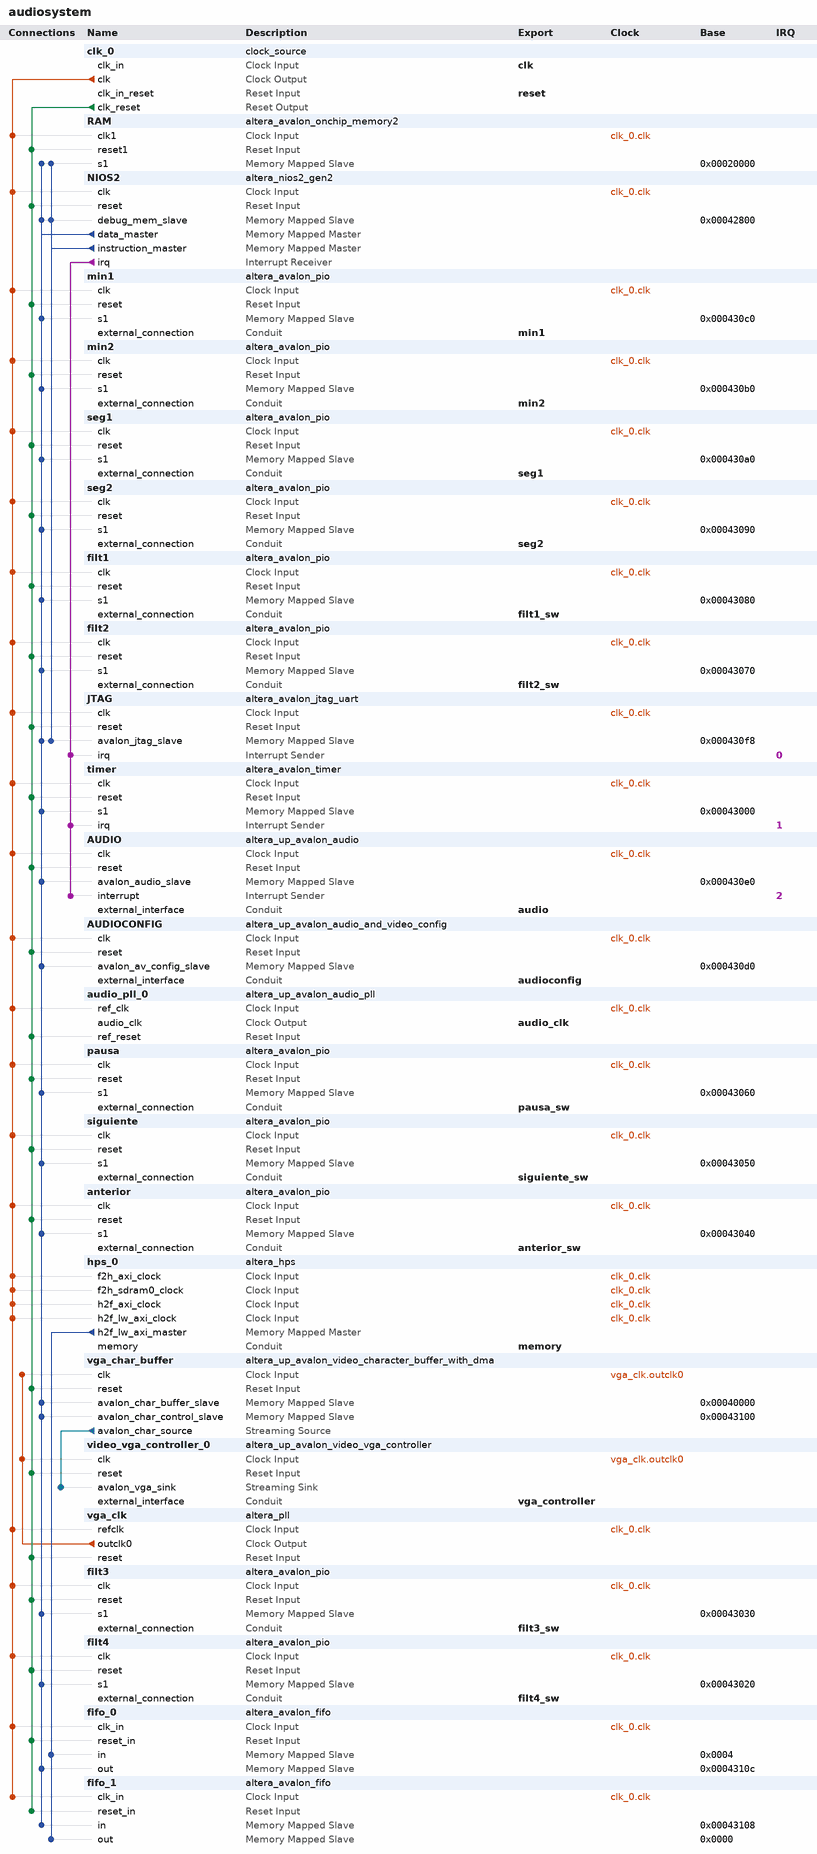
[diagram p0: system contents]
# Platform Designer (Qsys) system audiosystem, Cyclone V 5CSEMA5F31C6
# Parameters at their usual value, and those the tool derives, are not listed.
package require -exact qsys 18.1
create_system audiosystem
set_project_property DEVICE_FAMILY {Cyclone V}
set_project_property DEVICE 5CSEMA5F31C6

add_instance clk_0 clock_source 18.1
set_instance_parameter_value clk_0 clockFrequency 50000000

add_instance RAM altera_avalon_onchip_memory2 18.1
set_instance_parameter_value RAM dataWidth 32
set_instance_parameter_value RAM dualPort false
set_instance_parameter_value RAM initMemContent true
set_instance_parameter_value RAM initializationFileName onchip_mem.hex
set_instance_parameter_value RAM memorySize 131072

add_instance NIOS2 altera_nios2_gen2 18.1
set_instance_parameter_value NIOS2 dcache_size 2048
set_instance_parameter_value NIOS2 exceptionSlave RAM.s1
set_instance_parameter_value NIOS2 icache_size 4096
set_instance_parameter_value NIOS2 impl Tiny
set_instance_parameter_value NIOS2 resetSlave RAM.s1

add_instance min1 altera_avalon_pio 18.1
set_instance_parameter_value min1 direction Output
set_instance_parameter_value min1 width 7

add_instance min2 altera_avalon_pio 18.1
set_instance_parameter_value min2 direction Output
set_instance_parameter_value min2 width 7

add_instance seg1 altera_avalon_pio 18.1
set_instance_parameter_value seg1 direction Output
set_instance_parameter_value seg1 width 7

add_instance seg2 altera_avalon_pio 18.1
set_instance_parameter_value seg2 direction Output
set_instance_parameter_value seg2 width 7

add_instance filt1 altera_avalon_pio 18.1
set_instance_parameter_value filt1 direction Input
set_instance_parameter_value filt1 width 1

add_instance filt2 altera_avalon_pio 18.1
set_instance_parameter_value filt2 direction Input
set_instance_parameter_value filt2 width 1

add_instance JTAG altera_avalon_jtag_uart 18.1
set_instance_parameter_value JTAG simInteractiveOptions NO_INTERACTIVE_WINDOWS

add_instance timer altera_avalon_timer 18.1
set_instance_parameter_value timer period 1
set_instance_parameter_value timer periodUnits SEC

add_instance AUDIO altera_up_avalon_audio 18.0
set_instance_parameter_value AUDIO audio_in true
set_instance_parameter_value AUDIO avalon_bus_type {Memory Mapped}
set_instance_parameter_value AUDIO dw 16

add_instance AUDIOCONFIG altera_up_avalon_audio_and_video_config 18.0
set_instance_parameter_value AUDIOCONFIG audio_in {Microphone to ADC}
set_instance_parameter_value AUDIOCONFIG bit_length 24
set_instance_parameter_value AUDIOCONFIG board DE1-SoC
set_instance_parameter_value AUDIOCONFIG data_format {I2S Format}
set_instance_parameter_value AUDIOCONFIG line_in_bypass false
set_instance_parameter_value AUDIOCONFIG sampling_rate {48 kHz}

add_instance audio_pll_0 altera_up_avalon_audio_pll 18.0
set_instance_parameter_value audio_pll_0 gui_refclk 50.0

add_instance pausa altera_avalon_pio 18.1
set_instance_parameter_value pausa direction Input
set_instance_parameter_value pausa width 1

add_instance siguiente altera_avalon_pio 18.1
set_instance_parameter_value siguiente direction Input
set_instance_parameter_value siguiente width 1

add_instance anterior altera_avalon_pio 18.1
set_instance_parameter_value anterior direction Input
set_instance_parameter_value anterior width 1

add_instance hps_0 altera_hps 18.1
set_instance_parameter_value hps_0 EMAC1_Mode N/A
set_instance_parameter_value hps_0 EMAC1_PinMuxing Unused
set_instance_parameter_value hps_0 F2SCLK_COLDRST_Enable false
set_instance_parameter_value hps_0 F2SCLK_DBGRST_Enable false
set_instance_parameter_value hps_0 F2SCLK_WARMRST_Enable false
set_instance_parameter_value hps_0 F2SDRAM_Type AXI-3
set_instance_parameter_value hps_0 F2SDRAM_Width 64
set_instance_parameter_value hps_0 F2SINTERRUPT_Enable false
set_instance_parameter_value hps_0 F2S_Width 2
set_instance_parameter_value hps_0 FPGA_PERIPHERAL_OUTPUT_CLOCK_FREQ_EMAC0_GTX_CLK 125
set_instance_parameter_value hps_0 FPGA_PERIPHERAL_OUTPUT_CLOCK_FREQ_EMAC0_MD_CLK 2.5
set_instance_parameter_value hps_0 FPGA_PERIPHERAL_OUTPUT_CLOCK_FREQ_EMAC1_GTX_CLK 125
set_instance_parameter_value hps_0 FPGA_PERIPHERAL_OUTPUT_CLOCK_FREQ_EMAC1_MD_CLK 2.5
set_instance_parameter_value hps_0 HPS_PROTOCOL DDR3
set_instance_parameter_value hps_0 I2C0_Mode N/A
set_instance_parameter_value hps_0 I2C0_PinMuxing Unused
set_instance_parameter_value hps_0 I2C1_Mode N/A
set_instance_parameter_value hps_0 I2C1_PinMuxing Unused
set_instance_parameter_value hps_0 LWH2F_Enable true
set_instance_parameter_value hps_0 MEM_BANKADDR_WIDTH 3
set_instance_parameter_value hps_0 MEM_CLK_FREQ 300.0
set_instance_parameter_value hps_0 MEM_CLK_FREQ_MAX 400.0
set_instance_parameter_value hps_0 MEM_COL_ADDR_WIDTH 8
set_instance_parameter_value hps_0 MEM_DQ_WIDTH 8
set_instance_parameter_value hps_0 MEM_DRV_STR RZQ/6
set_instance_parameter_value hps_0 MEM_ROW_ADDR_WIDTH 12
set_instance_parameter_value hps_0 MEM_RTT_NOM {ODT Disabled}
set_instance_parameter_value hps_0 MEM_RTT_WR {Dynamic ODT off}
set_instance_parameter_value hps_0 MEM_TCL 7
set_instance_parameter_value hps_0 MEM_TFAW_NS 37.5
set_instance_parameter_value hps_0 MEM_TINIT_US 499
set_instance_parameter_value hps_0 MEM_TMRD_CK 3
set_instance_parameter_value hps_0 MEM_TRAS_NS 40.0
set_instance_parameter_value hps_0 MEM_TRCD_NS 15.0
set_instance_parameter_value hps_0 MEM_TREFI_US 7.0
set_instance_parameter_value hps_0 MEM_TRFC_NS 75.0
set_instance_parameter_value hps_0 MEM_TRP_NS 15.0
set_instance_parameter_value hps_0 MEM_TWTR 2
set_instance_parameter_value hps_0 MEM_VENDOR JEDEC
set_instance_parameter_value hps_0 MEM_WTCL 6
set_instance_parameter_value hps_0 MPU_EVENTS_Enable true
set_instance_parameter_value hps_0 QSPI_Mode N/A
set_instance_parameter_value hps_0 QSPI_PinMuxing Unused
set_instance_parameter_value hps_0 REF_CLK_FREQ 125.0
set_instance_parameter_value hps_0 S2FCLK_USER2CLK 5
set_instance_parameter_value hps_0 S2F_Width 2
set_instance_parameter_value hps_0 SDIO_Mode N/A
set_instance_parameter_value hps_0 SDIO_PinMuxing Unused
set_instance_parameter_value hps_0 SPIM1_Mode N/A
set_instance_parameter_value hps_0 SPIM1_PinMuxing Unused
set_instance_parameter_value hps_0 STM_Enable false
set_instance_parameter_value hps_0 TIMING_BOARD_AC_SKEW 0.02
set_instance_parameter_value hps_0 TIMING_BOARD_AC_TO_CK_SKEW 0.0
set_instance_parameter_value hps_0 TIMING_BOARD_DQ_TO_DQS_SKEW 0.0
set_instance_parameter_value hps_0 TIMING_BOARD_MAX_CK_DELAY 0.6
set_instance_parameter_value hps_0 TIMING_BOARD_MAX_DQS_DELAY 0.6
set_instance_parameter_value hps_0 TIMING_BOARD_SKEW_BETWEEN_DQS 0.02
set_instance_parameter_value hps_0 TIMING_BOARD_SKEW_CKDQS_DIMM_MAX 0.01
set_instance_parameter_value hps_0 TIMING_BOARD_SKEW_CKDQS_DIMM_MIN -0.01
set_instance_parameter_value hps_0 TIMING_BOARD_SKEW_WITHIN_DQS 0.02
set_instance_parameter_value hps_0 TIMING_TDH 125
set_instance_parameter_value hps_0 TIMING_TDQSCK 400
set_instance_parameter_value hps_0 TIMING_TDQSQ 120
set_instance_parameter_value hps_0 TIMING_TDS 50
set_instance_parameter_value hps_0 TIMING_TIH 250
set_instance_parameter_value hps_0 TIMING_TIS 175
set_instance_parameter_value hps_0 TIMING_TQSH 0.38
set_instance_parameter_value hps_0 UART0_Mode N/A
set_instance_parameter_value hps_0 UART0_PinMuxing Unused
set_instance_parameter_value hps_0 USB1_Mode N/A
set_instance_parameter_value hps_0 USB1_PinMuxing Unused
set_instance_parameter_value hps_0 desired_cfg_clk_mhz 100.0
set_instance_parameter_value hps_0 desired_qspi_clk_mhz 400.0

add_instance vga_char_buffer altera_up_avalon_video_character_buffer_with_dma 18.0
set_instance_parameter_value vga_char_buffer enable_transparency false

add_instance video_vga_controller_0 altera_up_avalon_video_vga_controller 18.0
set_instance_parameter_value video_vga_controller_0 board DE1-SoC
set_instance_parameter_value video_vga_controller_0 resolution {VGA 640x480}

add_instance vga_clk altera_pll 18.1
set_instance_parameter_value vga_clk gui_device_speed_grade 1
set_instance_parameter_value vga_clk gui_number_of_clocks 1
set_instance_parameter_value vga_clk gui_operation_mode direct
set_instance_parameter_value vga_clk gui_output_clock_frequency0 25.0
set_instance_parameter_value vga_clk gui_pll_mode {Integer-N PLL}
set_instance_parameter_value vga_clk gui_reference_clock_frequency 50.0
set_instance_parameter_value vga_clk gui_use_locked true

add_instance filt3 altera_avalon_pio 18.1
set_instance_parameter_value filt3 direction Input
set_instance_parameter_value filt3 width 1

add_instance filt4 altera_avalon_pio 18.1
set_instance_parameter_value filt4 direction Input
set_instance_parameter_value filt4 width 1

add_instance fifo_0 altera_avalon_fifo 18.1
set_instance_parameter_value fifo_0 bitsPerSymbol 16
set_instance_parameter_value fifo_0 channelWidth 8
set_instance_parameter_value fifo_0 errorWidth 8
set_instance_parameter_value fifo_0 fifoDepth 16
set_instance_parameter_value fifo_0 fifoInputInterfaceOptions AVALONMM_WRITE
set_instance_parameter_value fifo_0 fifoOutputInterfaceOptions AVALONMM_READ
set_instance_parameter_value fifo_0 singleClockMode true
set_instance_parameter_value fifo_0 symbolsPerBeat 2
set_instance_parameter_value fifo_0 useIRQ false
set_instance_parameter_value fifo_0 usePacket true
set_instance_parameter_value fifo_0 useReadControl false
set_instance_parameter_value fifo_0 useWriteControl false

add_instance fifo_1 altera_avalon_fifo 18.1
set_instance_parameter_value fifo_1 bitsPerSymbol 16
set_instance_parameter_value fifo_1 channelWidth 8
set_instance_parameter_value fifo_1 errorWidth 8
set_instance_parameter_value fifo_1 fifoDepth 16
set_instance_parameter_value fifo_1 fifoInputInterfaceOptions AVALONMM_WRITE
set_instance_parameter_value fifo_1 fifoOutputInterfaceOptions AVALONMM_READ
set_instance_parameter_value fifo_1 singleClockMode true
set_instance_parameter_value fifo_1 symbolsPerBeat 2
set_instance_parameter_value fifo_1 useIRQ true
set_instance_parameter_value fifo_1 usePacket true
set_instance_parameter_value fifo_1 useReadControl false
set_instance_parameter_value fifo_1 useWriteControl false

# connections
add_connection clk_0.clk anterior.clk clock
add_connection clk_0.clk AUDIO.clk clock
add_connection clk_0.clk audio_pll_0.ref_clk clock
add_connection clk_0.clk AUDIOCONFIG.clk clock
add_connection clk_0.clk fifo_0.clk_in clock
add_connection clk_0.clk fifo_1.clk_in clock
add_connection clk_0.clk filt1.clk clock
add_connection clk_0.clk filt2.clk clock
add_connection clk_0.clk filt3.clk clock
add_connection clk_0.clk filt4.clk clock
add_connection clk_0.clk hps_0.f2h_axi_clock clock
add_connection clk_0.clk hps_0.f2h_sdram0_clock clock
add_connection clk_0.clk hps_0.h2f_axi_clock clock
add_connection clk_0.clk hps_0.h2f_lw_axi_clock clock
add_connection clk_0.clk JTAG.clk clock
add_connection clk_0.clk min1.clk clock
add_connection clk_0.clk min2.clk clock
add_connection clk_0.clk NIOS2.clk clock
add_connection clk_0.clk pausa.clk clock
add_connection clk_0.clk RAM.clk1 clock
add_connection clk_0.clk seg1.clk clock
add_connection clk_0.clk seg2.clk clock
add_connection clk_0.clk siguiente.clk clock
add_connection clk_0.clk timer.clk clock
add_connection clk_0.clk vga_clk.refclk clock
add_connection vga_clk.outclk0 vga_char_buffer.clk clock
add_connection vga_clk.outclk0 video_vga_controller_0.clk clock
add_connection clk_0.clk_reset anterior.reset reset
add_connection clk_0.clk_reset AUDIO.reset reset
add_connection clk_0.clk_reset audio_pll_0.ref_reset reset
add_connection clk_0.clk_reset AUDIOCONFIG.reset reset
add_connection clk_0.clk_reset fifo_0.reset_in reset
add_connection clk_0.clk_reset fifo_1.reset_in reset
add_connection clk_0.clk_reset filt1.reset reset
add_connection clk_0.clk_reset filt2.reset reset
add_connection clk_0.clk_reset filt3.reset reset
add_connection clk_0.clk_reset filt4.reset reset
add_connection clk_0.clk_reset JTAG.reset reset
add_connection clk_0.clk_reset min1.reset reset
add_connection clk_0.clk_reset min2.reset reset
add_connection clk_0.clk_reset NIOS2.reset reset
add_connection clk_0.clk_reset pausa.reset reset
add_connection clk_0.clk_reset RAM.reset1 reset
add_connection clk_0.clk_reset seg1.reset reset
add_connection clk_0.clk_reset seg2.reset reset
add_connection clk_0.clk_reset siguiente.reset reset
add_connection clk_0.clk_reset timer.reset reset
add_connection clk_0.clk_reset vga_char_buffer.reset reset
add_connection clk_0.clk_reset vga_clk.reset reset
add_connection clk_0.clk_reset video_vga_controller_0.reset reset
add_connection hps_0.h2f_lw_axi_master fifo_0.in avalon
set_connection_parameter_value hps_0.h2f_lw_axi_master/fifo_0.in baseAddress 0x0004
add_connection hps_0.h2f_lw_axi_master fifo_1.out avalon
set_connection_parameter_value hps_0.h2f_lw_axi_master/fifo_1.out baseAddress 0x0000
add_connection NIOS2.data_master anterior.s1 avalon
set_connection_parameter_value NIOS2.data_master/anterior.s1 baseAddress 0x00043040
add_connection NIOS2.data_master AUDIO.avalon_audio_slave avalon
set_connection_parameter_value NIOS2.data_master/AUDIO.avalon_audio_slave baseAddress 0x000430e0
add_connection NIOS2.data_master AUDIOCONFIG.avalon_av_config_slave avalon
set_connection_parameter_value NIOS2.data_master/AUDIOCONFIG.avalon_av_config_slave baseAddress 0x000430d0
add_connection NIOS2.data_master fifo_0.out avalon
set_connection_parameter_value NIOS2.data_master/fifo_0.out baseAddress 0x0004310c
add_connection NIOS2.data_master fifo_1.in avalon
set_connection_parameter_value NIOS2.data_master/fifo_1.in baseAddress 0x00043108
add_connection NIOS2.data_master filt1.s1 avalon
set_connection_parameter_value NIOS2.data_master/filt1.s1 baseAddress 0x00043080
add_connection NIOS2.data_master filt2.s1 avalon
set_connection_parameter_value NIOS2.data_master/filt2.s1 baseAddress 0x00043070
add_connection NIOS2.data_master filt3.s1 avalon
set_connection_parameter_value NIOS2.data_master/filt3.s1 baseAddress 0x00043030
add_connection NIOS2.data_master filt4.s1 avalon
set_connection_parameter_value NIOS2.data_master/filt4.s1 baseAddress 0x00043020
add_connection NIOS2.data_master JTAG.avalon_jtag_slave avalon
set_connection_parameter_value NIOS2.data_master/JTAG.avalon_jtag_slave baseAddress 0x000430f8
add_connection NIOS2.data_master min1.s1 avalon
set_connection_parameter_value NIOS2.data_master/min1.s1 baseAddress 0x000430c0
add_connection NIOS2.data_master min2.s1 avalon
set_connection_parameter_value NIOS2.data_master/min2.s1 baseAddress 0x000430b0
add_connection NIOS2.data_master NIOS2.debug_mem_slave avalon
set_connection_parameter_value NIOS2.data_master/NIOS2.debug_mem_slave baseAddress 0x00042800
add_connection NIOS2.data_master pausa.s1 avalon
set_connection_parameter_value NIOS2.data_master/pausa.s1 baseAddress 0x00043060
add_connection NIOS2.data_master RAM.s1 avalon
set_connection_parameter_value NIOS2.data_master/RAM.s1 baseAddress 0x00020000
add_connection NIOS2.data_master seg1.s1 avalon
set_connection_parameter_value NIOS2.data_master/seg1.s1 baseAddress 0x000430a0
add_connection NIOS2.data_master seg2.s1 avalon
set_connection_parameter_value NIOS2.data_master/seg2.s1 baseAddress 0x00043090
add_connection NIOS2.data_master siguiente.s1 avalon
set_connection_parameter_value NIOS2.data_master/siguiente.s1 baseAddress 0x00043050
add_connection NIOS2.data_master timer.s1 avalon
set_connection_parameter_value NIOS2.data_master/timer.s1 baseAddress 0x00043000
add_connection NIOS2.data_master vga_char_buffer.avalon_char_buffer_slave avalon
set_connection_parameter_value NIOS2.data_master/vga_char_buffer.avalon_char_buffer_slave baseAddress 0x00040000
add_connection NIOS2.data_master vga_char_buffer.avalon_char_control_slave avalon
set_connection_parameter_value NIOS2.data_master/vga_char_buffer.avalon_char_control_slave baseAddress 0x00043100
add_connection NIOS2.instruction_master JTAG.avalon_jtag_slave avalon
set_connection_parameter_value NIOS2.instruction_master/JTAG.avalon_jtag_slave baseAddress 0x000430f8
add_connection NIOS2.instruction_master NIOS2.debug_mem_slave avalon
set_connection_parameter_value NIOS2.instruction_master/NIOS2.debug_mem_slave baseAddress 0x00042800
add_connection NIOS2.instruction_master RAM.s1 avalon
set_connection_parameter_value NIOS2.instruction_master/RAM.s1 baseAddress 0x00020000
add_connection vga_char_buffer.avalon_char_source video_vga_controller_0.avalon_vga_sink avalon_streaming
add_connection NIOS2.irq AUDIO.interrupt interrupt
set_connection_parameter_value NIOS2.irq/AUDIO.interrupt irqNumber 2
add_connection NIOS2.irq JTAG.irq interrupt
set_connection_parameter_value NIOS2.irq/JTAG.irq irqNumber 0
add_connection NIOS2.irq timer.irq interrupt
set_connection_parameter_value NIOS2.irq/timer.irq irqNumber 1

# exported interfaces
add_interface anterior_sw conduit end
set_interface_property anterior_sw EXPORT_OF anterior.external_connection
add_interface audio conduit end
set_interface_property audio EXPORT_OF AUDIO.external_interface
add_interface audio_clk clock source
set_interface_property audio_clk EXPORT_OF audio_pll_0.audio_clk
add_interface audioconfig conduit end
set_interface_property audioconfig EXPORT_OF AUDIOCONFIG.external_interface
add_interface clk clock sink
set_interface_property clk EXPORT_OF clk_0.clk_in
add_interface filt1_sw conduit end
set_interface_property filt1_sw EXPORT_OF filt1.external_connection
add_interface filt2_sw conduit end
set_interface_property filt2_sw EXPORT_OF filt2.external_connection
add_interface filt3_sw conduit end
set_interface_property filt3_sw EXPORT_OF filt3.external_connection
add_interface filt4_sw conduit end
set_interface_property filt4_sw EXPORT_OF filt4.external_connection
add_interface memory conduit end
set_interface_property memory EXPORT_OF hps_0.memory
add_interface min1 conduit end
set_interface_property min1 EXPORT_OF min1.external_connection
add_interface min2 conduit end
set_interface_property min2 EXPORT_OF min2.external_connection
add_interface pausa_sw conduit end
set_interface_property pausa_sw EXPORT_OF pausa.external_connection
add_interface reset reset sink
set_interface_property reset EXPORT_OF clk_0.clk_in_reset
add_interface seg1 conduit end
set_interface_property seg1 EXPORT_OF seg1.external_connection
add_interface seg2 conduit end
set_interface_property seg2 EXPORT_OF seg2.external_connection
add_interface siguiente_sw conduit end
set_interface_property siguiente_sw EXPORT_OF siguiente.external_connection
add_interface vga_controller conduit end
set_interface_property vga_controller EXPORT_OF video_vga_controller_0.external_interface

set_interconnect_requirement {$system} qsys_mm.clockCrossingAdapter HANDSHAKE
set_interconnect_requirement {$system} qsys_mm.enableEccProtection FALSE
set_interconnect_requirement {$system} qsys_mm.insertDefaultSlave FALSE
set_interconnect_requirement {$system} qsys_mm.maxAdditionalLatency 1

save_system audiosystem.qsys
